# EAGLE schematic schematic (EAGLE 9.3.0)
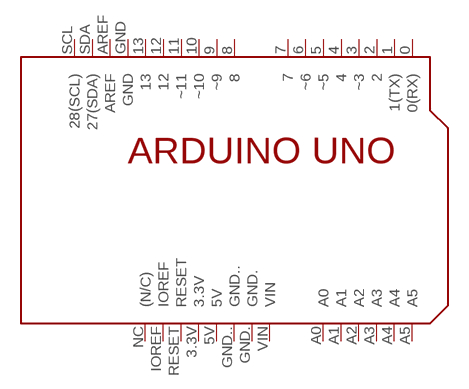
[diagram p0: schematic, sheet 1]

## Parts
U$1  ARDUINO_UNO_SHIELD"  [ARDUINO_UNO_SHIELD]
Unconnected: U$1.0(0(RX)) U$1.1(1(TX)) U$1.2 U$1.3(~3) U$1.3.3V U$1.4 U$1.5(~5) U$1.5V U$1.6(~6) U$1.7 U$1.8 U$1.9(~9) U$1.10(~10) U$1.11(~11) U$1.12 U$1.13 U$1.A0 U$1.A1 U$1.A2 U$1.A3 U$1.A4 U$1.A5 U$1.AREF U$1.GND U$1.GND. U$1.GND.. U$1.IOREF U$1.NC((N/C)) U$1.RESET U$1.SCL(28(SCL)) U$1.SDA(27(SDA)) U$1.VIN

## Library data of the parts
U$1 = E14_Arduino_revB:ARDUINO_UNO_SHIELD